# Altium schematic sheet TPS2660 Efuse.SchDoc
size A; SheetNumber: 1; SheetTotal: 4
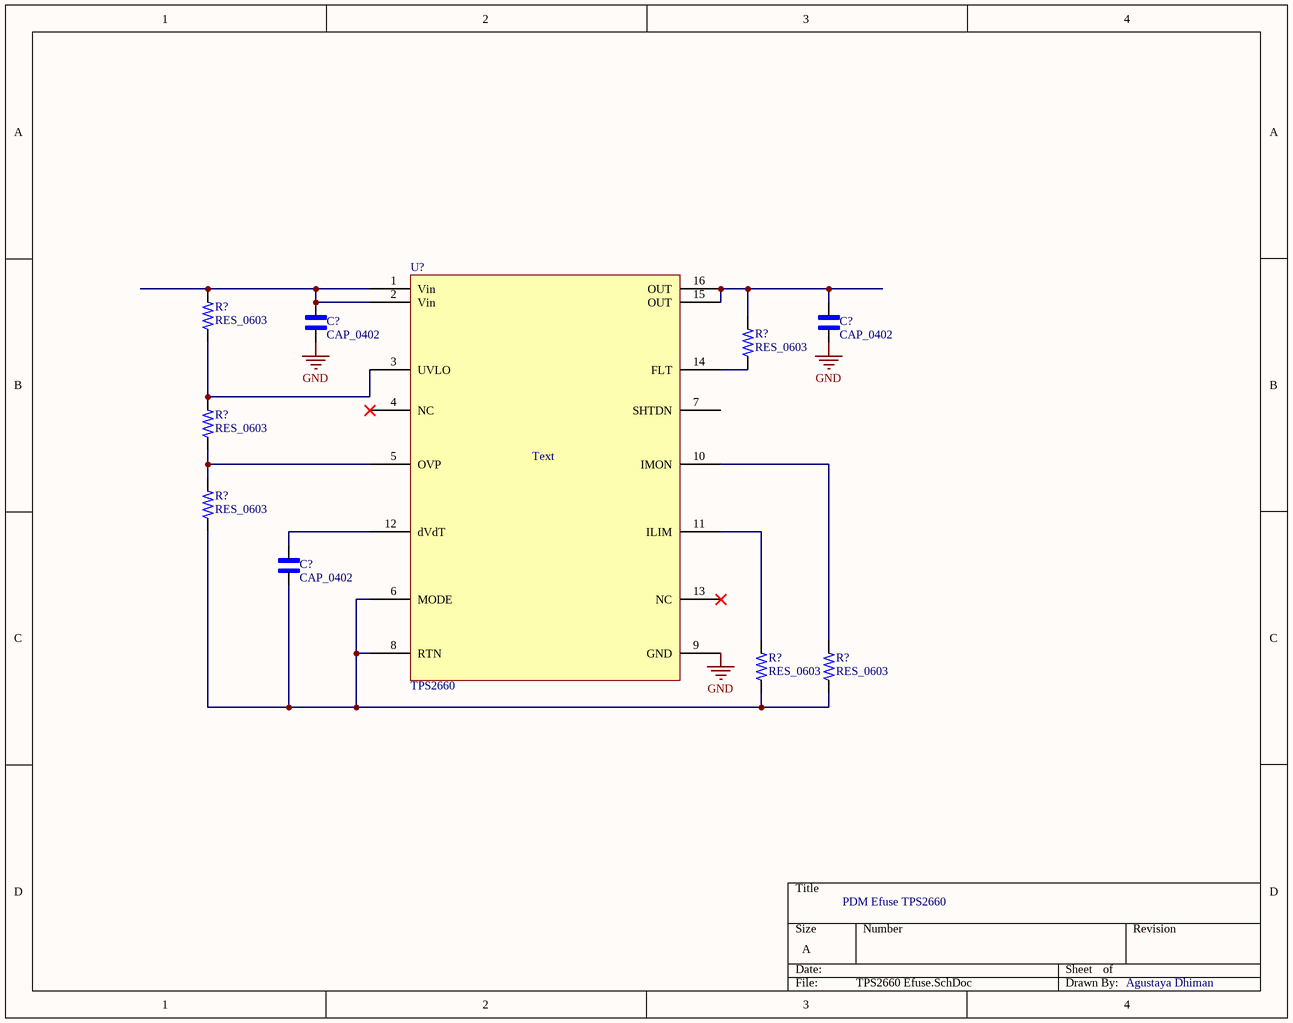
[diagram p0: TPS2660 Efuse.SchDoc]

## Parts
(Parts that share a designator on the sheet are numbered #1, #2 ... from top to bottom, then left to right.)
C?#1  CAP_0402  [CAP_0402-Footprint-1]
C?#2  CAP_0402  [CAP_0402-Footprint-1]
C?#3  CAP_0402  [CAP_0402-Footprint-1]
R?#1  RES_0603  [RES_0603-Footprint-1]
R?#2  RES_0603  [RES_0603-Footprint-1]
R?#3  RES_0603  [RES_0603-Footprint-1]
R?#4  RES_0603  [RES_0603-Footprint-1]
R?#5  RES_0603  [RES_0603-Footprint-1]
R?#6  RES_0603  [RES_0603-Footprint-1]
U?  TPS2660

## Nets
GND: C?#1.1 C?#2.1 U?.9(GND)
NetC?#1_2: C?#1.2 R?#1.2 U?.1(Vin) U?.2(Vin)
NetC?#2_2: C?#2.2 R?#2.2 U?.15(OUT) U?.16(OUT)
NetC?#3_1: C?#3.1 R?#4.1 R?#5.1 R?#6.1 U?.6(MODE) U?.8(RTN)
NetC?#3_2: C?#3.2 U?.12(dVdT)
NetR?#1_1: R?#1.1 R?#3.2 U?.3(UVLO)
NetR?#2_1: R?#2.1 U?.14(FLT)
NetR?#3_1: R?#3.1 R?#4.2 U?.5(OVP)
NetR?#5_2: R?#5.2 U?.11(ILIM)
NetR?#6_2: R?#6.2 U?.10(IMON)

Not connected (* = marked no-connect by the designer): U? 4(NC)* 7(SHTDN) 13(NC)*

## Notes on the sheet
- PDM Efuse TPS2660
- Agustaya Dhiman
- (in symbol TPS2660) Text

## Library data of the parts
C?#1-C?#3 = CMP-00063-1: Generic 0402 Capacitor
R?#1-R?#6 = CMP-00013-5: 0603 Generic Resistor
U? = TPS2660: TPS2660x, Efuse; ComponentLink1Description: DataSheet; ComponentLink1URL: https://www.ti.com/lit/ds/symlink/tps2660.pdf?ts=1762009075200